# Altium schematic sheet MAX96717_PINOUT.SchDoc
size C; SheetNumber: 4; SheetTotal: 4
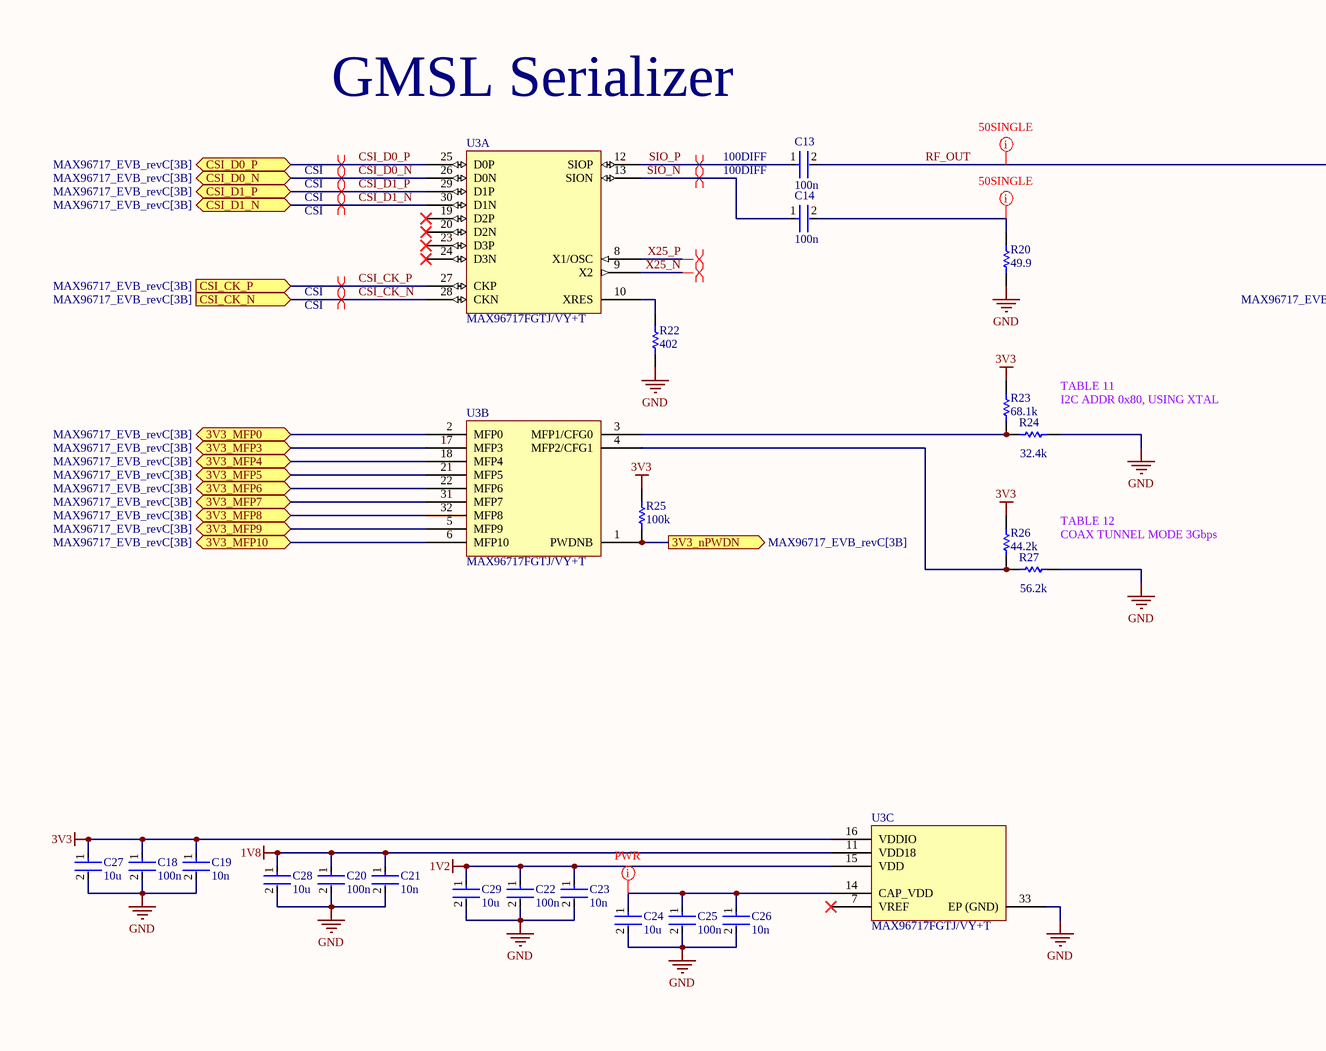
[diagram p0: MAX96717_PINOUT.SchDoc, left]
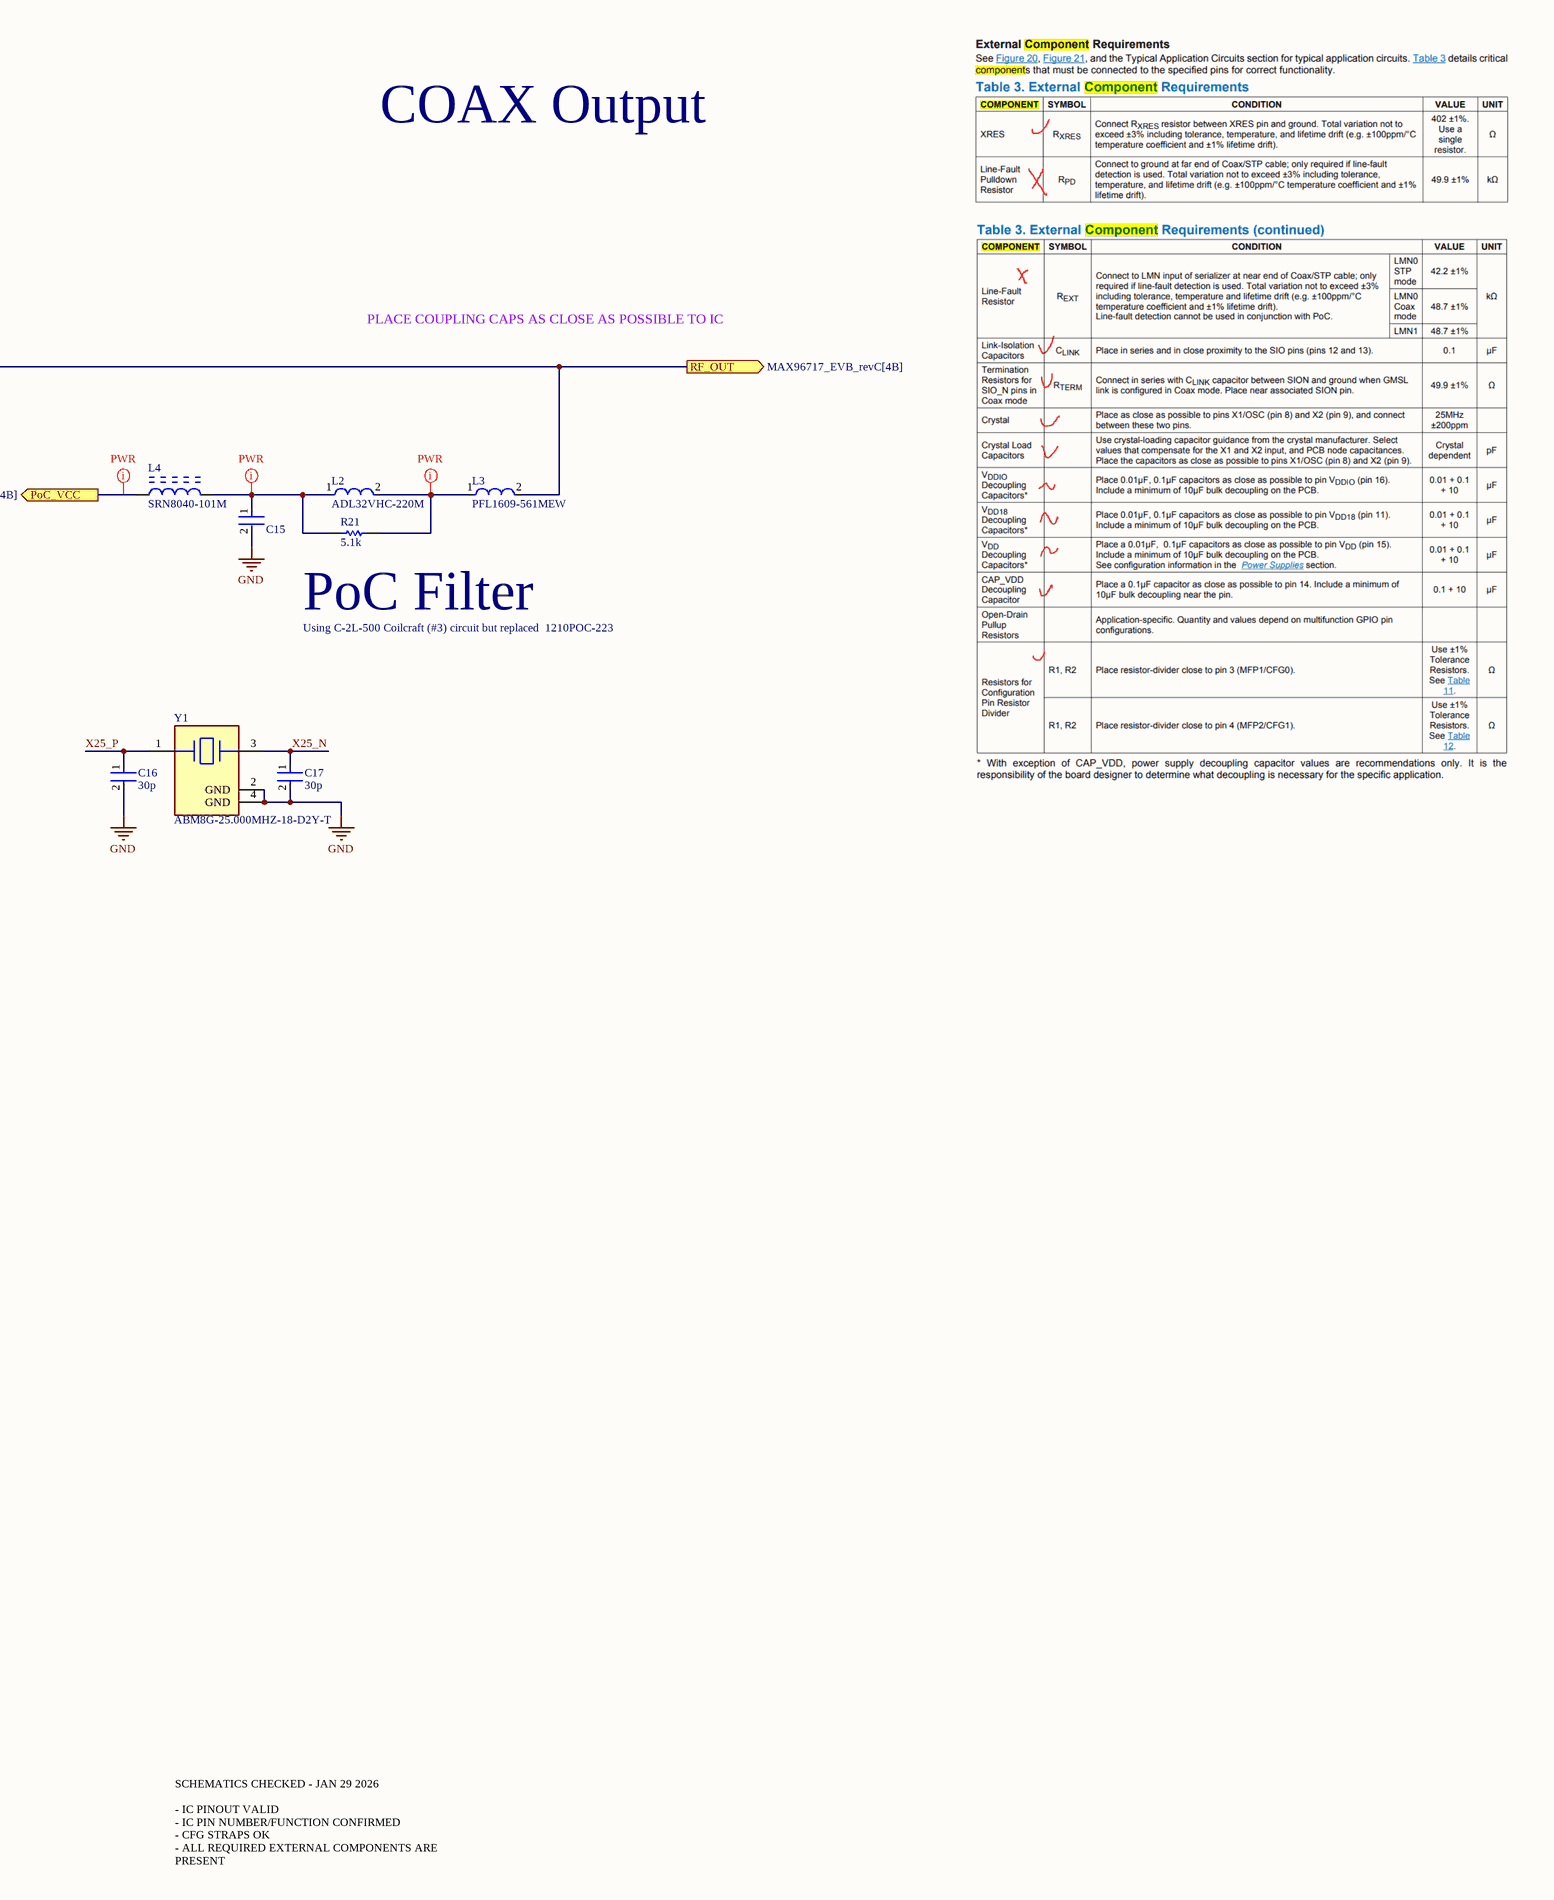
[diagram p1: MAX96717_PINOUT.SchDoc, right]

## Parts
C13  100n  [FP-0402-L_1_0_0_05-W_0_5-IPC_A]
C14  100n  [FP-0402-L_1_0_0_05-W_0_5-IPC_A]
C15  GRM21BR61E226ME44L  [FP-GRM21B-0_2-e0_2_0_7-IPC_B]  (value not drawn)
C16  30p  [FP-0402-L_1_0_0_05-W_0_5-IPC_A]
C17  30p  [FP-0402-L_1_0_0_05-W_0_5-IPC_A]
C18  100n  [FP-0402-L_1_0_0_05-W_0_5-IPC_A]
C19  10n  [FP-0402-L_1_0_0_05-W_0_5-IPC_A]
C20  100n  [FP-0402-L_1_0_0_05-W_0_5-IPC_A]
C21  10n  [FP-0402-L_1_0_0_05-W_0_5-IPC_A]
C22  100n  [FP-0402-L_1_0_0_05-W_0_5-IPC_A]
C23  10n  [FP-0402-L_1_0_0_05-W_0_5-IPC_A]
C24  10u  [FP-0402-L_1_0_0_05-W_0_5-IPC_A]
C25  100n  [FP-0402-L_1_0_0_05-W_0_5-IPC_A]
C26  10n  [FP-0402-L_1_0_0_05-W_0_5-IPC_A]
C27  10u  [FP-0402-L_1_0_0_05-W_0_5-IPC_A]
C28  10u  [FP-0402-L_1_0_0_05-W_0_5-IPC_A]
C29  10u  [FP-0402-L_1_0_0_05-W_0_5-IPC_A]
L2  ADL32VHC-220M  [FP-1210POC-MFG]
L3  PFL1609-561MEW  [FP-PFL1609-MFG]
L4  SRN8040-101M  [BOUR-SRN8040-101M_V]
R20  49.9  [R0603B]
R21  5.1k  [R0603B]
R22  402  [R0603B]
R23  68.1k  [R0603B]
R24  32.4k  [R0603B]
R25  100k  [R0603B]
R26  44.2k  [R0603B]
R27  56.2k  [R0603B]
U3  MAX96717FGTJ/VY+T  [QFN50P500X500X80_HS-33N]  (parts A,B,C of 3)
Y1  ABM8G-25.000MHZ-18-D2Y-T  [FP-ABM8G-MFG]

## Ports
3V3_MFP0 (bidir, see MAX96717_EVB_revC[3B]), 3V3_MFP3 (bidir, see MAX96717_EVB_revC[3B]), 3V3_MFP4 (bidir, see MAX96717_EVB_revC[3B]), 3V3_MFP5 (bidir, see MAX96717_EVB_revC[3B]), 3V3_MFP6 (bidir, see MAX96717_EVB_revC[3B]), 3V3_MFP7 (bidir, see MAX96717_EVB_revC[3B]), 3V3_MFP8 (bidir, see MAX96717_EVB_revC[3B]), 3V3_MFP9 (bidir, see MAX96717_EVB_revC[3B]), 3V3_MFP10 (bidir, see MAX96717_EVB_revC[3B]), 3V3_nPWDN (out, see MAX96717_EVB_revC[3B]), CSI_CK_N (in, see MAX96717_EVB_revC[3B]), CSI_CK_P (in, see MAX96717_EVB_revC[3B]), CSI_D0_N (bidir, see MAX96717_EVB_revC[3B]), CSI_D0_P (bidir, see MAX96717_EVB_revC[3B]), CSI_D1_N (bidir, see MAX96717_EVB_revC[3B]), CSI_D1_P (bidir, see MAX96717_EVB_revC[3B]), PoC_VCC (out, see MAX96717_EVB_revC[4B]), RF_OUT (out, see MAX96717_EVB_revC[4B])

## Nets
1V2: C22.1 C23.1 C29.1 U3.15(VDD)
1V8: C20.1 C21.1 C28.1 U3.11(VDD18)
3V3: C18.1 C19.1 C27.1 R23.2 R25.2 R26.2 U3.16(VDDIO)
GND: C15.2 C16.2 C17.2 C18.2 C19.2 C20.2 C21.2 C22.2 C23.2 C24.2 C25.2 C26.2 C27.2 C28.2 C29.2 R20.1 R22.1 R24.1 R27.1 U3.33(EP_(GND)) Y1.2(GND) Y1.4(GND)
3V3_MFP0: U3.2(MFP0) ; port 3V3_MFP0
3V3_MFP3: U3.17(MFP3) ; port 3V3_MFP3
3V3_MFP4: U3.18(MFP4) ; port 3V3_MFP4
3V3_MFP5: U3.21(MFP5) ; port 3V3_MFP5
3V3_MFP6: U3.22(MFP6) ; port 3V3_MFP6
3V3_MFP7: U3.31(MFP7) ; port 3V3_MFP7
3V3_MFP8: U3.32(MFP8) ; port 3V3_MFP8
3V3_MFP9: U3.5(MFP9) ; port 3V3_MFP9
3V3_MFP10: U3.6(MFP10) ; port 3V3_MFP10
3V3_nPWDN: R25.1 U3.1(PWDNB) ; port 3V3_nPWDN
CSI_CK_N: U3.28(CKN) ; port CSI_CK_N
CSI_CK_P: U3.27(CKP) ; port CSI_CK_P
CSI_D0_N: U3.26(D0N) ; port CSI_D0_N
CSI_D0_P: U3.25(D0P) ; port CSI_D0_P
CSI_D1_N: U3.30(D1N) ; port CSI_D1_N
CSI_D1_P: U3.29(D1P) ; port CSI_D1_P
PoC_VCC: L4.1 ; port PoC_VCC
RF_OUT: C13.2 L3.2 ; port RF_OUT
SIO_N: C14.1 U3.13(SION)
SIO_P: C13.1 U3.12(SIOP)
X25_N: C17.1 U3.9(X2) Y1.3
X25_P: C16.1 U3.8(X1/OSC) Y1.1
NetC14_2: C14.2 R20.2
NetC15_1: C15.1 L2.1 L4.2 R21.2
NetC24_1: C24.1 C25.1 C26.1 U3.14(CAP_VDD)
NetL2_2: L2.2 L3.1 R21.1
NetR22_2: R22.2 U3.10(XRES)
NetR23_1: R23.1 R24.2 U3.3(MFP1/CFG0)
NetR26_1: R26.1 R27.2 U3.4(MFP2/CFG1)

Not connected (* = marked no-connect by the designer): U3 7(VREF)* 19(D2P)* 20(D2N)* 23(D3P)* 24(D3N)*

## Layout directives
differential pair: X25_N, X25_P
differential pair; differential pair class CSI: CSI_CK_N, CSI_CK_P, CSI_D0_N, CSI_D0_P, CSI_D1_N, CSI_D1_P
differential pair; differential pair class 100DIFF: SIO_N, SIO_P
net class PWR: NetC15_1, NetC24_1, NetL2_2, PoC_VCC
net class 50SINGLE: NetC14_2, RF_OUT

## Notes on the sheet
- COAX Output
- GMSL Serializer
- PLACE COUPLING CAPS AS CLOSE AS POSSIBLE TO IC
- TABLE 11
- (near R24) I2C ADDR 0x80, USING XTAL
- Using C-2L-500 Coilcraft (#3) circuit but replaced  1210POC-223
- (near R21) PoC Filter
- TABLE 12
- (near R27) COAX TUNNEL MODE 3Gbps
- SCHEMATICS CHECKED - JAN 29 2026
  - IC PINOUT VALID
  - IC PIN NUMBER/FUNCTION CONFIRMED
  - CFG STRAPS OK
  - ALL REQUIRED EXTERNAL COMPONENTS ARE PRESENT

## Library data of the parts
C13 C14 C16-C29 = CMP-001-00058-1: LARGE PADS, 0402 CAP, CHANGE COMMENT TO MATCH REAL P/N; Capacitor Type: Ceramic; Min Operating Temperature: -55°C; Mounting Technology: Surface Mount; Pins: 2; Case/Package: 0402; RoHS Compliant: Yes; Max Operating Temperature: 85°C
C15 = CMP-2007-03222-3: Chip Multilayer Ceramic Capacitors for General Purpose, 0805, 22uF, X5R, 15%, 20%, 25V; Case/Package: 0805; Depth: 1.25mm; Resistor Type: Ceramic; Voltage Rating: 25V; Lead Free: Lead Free; Voltage Rating (DC): 25V; Case Code (Metric): 2012; Thickness: 0.057inch; REACH SVHC: No SVHC; Material: Ceramic; Tolerance: 20%; Length: 2mm; Capacitance: 22uF; Case Code (Imperial): 0805; Max Operating Temperature: 85°C; Termination: SMD/SMT; Weight: 0.000335oz; Dielectric: X5R; Packaging: Tape and Reel; Voltage: 25V; Package Quantity: 3000; Height: 1.25mm; Mount: Surface Mount; Width: 1.25mm; Min Operating Temperature: -55°C
L2 = CMP-11268-000041-1: NOT COILCRAFT - ACTUAL P# --> ADL32VHC-220M / - Power Injection Chokes for PoC; Manufacturer Part Number: 1210POC-223MRC; Value: 22uH; Core Material: Ferrite; Saturation Current: 720mA; Series Resistance: 0.88Ω; Rms Current: 700mA; Automotive Grade: Grade 1; Self Resonant Frequency: 70MHz; Test Frequency: 100kHz; Tolerance: 20%; Ambient Temperature Range High: +125°C; Manufacturer: coilcraft; Octopart: https://octopart.com/1210poc-223mrc-coilcraft-103207315; Category: Ind; Device Class L2: Inductors; RoHS: TRUE; Device Class L3: Fixed Inductors; Package: 1210POC; Ambient Temperature Range Low: -40°C; ComponentLink2URL: https://drive.google.com/open?id=15FlOq8Y4YbRFohfA_cJ40jgnqs8va2Mh; Lead Free: Yes; Inductance: 22uH; Device Class L1: Passive Components; ComponentLink2Description: Datasheet; Automotive: Yes; Height: 3mm
L3 = CMP-11268-000007-1: Fixed Inductors PFL1609 Low Profile 0.56 uH 20 % 1.4 A; Manufacturer: coilcraft; Rms Current: 1100mA; Self Resonant Frequency: 600MHz; Core Material: Composite; Tolerance: 20%; Value: 0.56uH; Automotive Grade: Grade 1; Saturation Current: 710mA; Test Frequency: 7.9MHz; Shielding: true; Series Resistance: 130mΩ; Lead Free: Yes; Device Class L1: Passive Components; Package: PFL1609; Octopart: https://octopart.com/pfl1609-561mew-coilcraft-20329171; ComponentLink2URL: https://www.coilcraft.com/pdfs/pfl1609.pdf; Manufacturer Part Number: PFL1609-561MEW; Ambient Temperature Range Low: -40°C; Composition: Wirewound; Inductance: 0.56uH; Device Class L2: Inductors; Category: Ind; Device Class L3: Fixed Inductors; Mouser Description: Fixed Inductors PFL1609 Low Profile 0.56 uH 20 % 1.4 A; Automotive: Yes; ComponentLink2Description: Datasheet; Ambient Temperature Range High: +105°C; Height: 0.95mm; RoHS: TRUE
L4 = CMP-2000-07143-1: Semi-Shielded Power Inductor, 100 uH, -40 to 125 degC, 2-Pin SMD, RoHS, Tape and Reel; Manufacturer: Bourns; Tolerance: ±20 / %; Brand/Series: SRN8040Series; Current, Rating: 1 / A; Inductance: 100 / µH; Manufacturer URL: http://www.bourns.com/; Package Description: 2-Pin Surface Mount Device, Body 8 x 8 mm; Datasheet URL: http://www.produktinfo.conrad.com/datenblaetter/1000000-1099999/001056456-da-01-en-MAG_ABG_LEIST_IND_SRN8040_101M_100UH_SMD.pdf; Datasheet Version: 08/2013; Termination: SMT; Type: Power; Mounting Technology: SurfaceMount; Package Reference: SRN8040-101M
R20-R24 R26 R27 = CMP-009-00002-14: Resistor; Value: 100k
R25 = CMP-009-00002-14: Resistor; Value: 100k
U3 = CMP-015-00012-2: 3Gbps Serializer TQFN-32 Serializers / Deserializers ROHS
Y1 = CMP-2000-05733-3: Crystal 25MHz ±20ppm (Tol) ±30ppm (Stability) 18pF FUND 60Ω 4-Pin SMD T/R; Series Resistance: 60R; Length: 3.2mm; Depth: 2.5mm; Packaging: Tape and Reel; Min Operating Temperature: -40°C; Operating Frequency: 25 MHz; Lead Free: Lead Free; Number of Pins: 4; Frequency Tolerance: 20ppm; Radiation Hardening: No; Max Operating Temperature: 85°C; Termination: SMD/SMT; Frequency Stability: 30ppm; Frequency: 25MHz; Series: ABM8G; Mount: Surface Mount; Package Quantity: 1000; Height: 0.039inch; Width: 0.098inch; Case/Package: CSMD; ESR (Equivalent Series Resistance): 60R; Load Capacitance: 18pF; Tolerance: 20ppm